# Altium project delta-sigma_modulator.PrjPcb
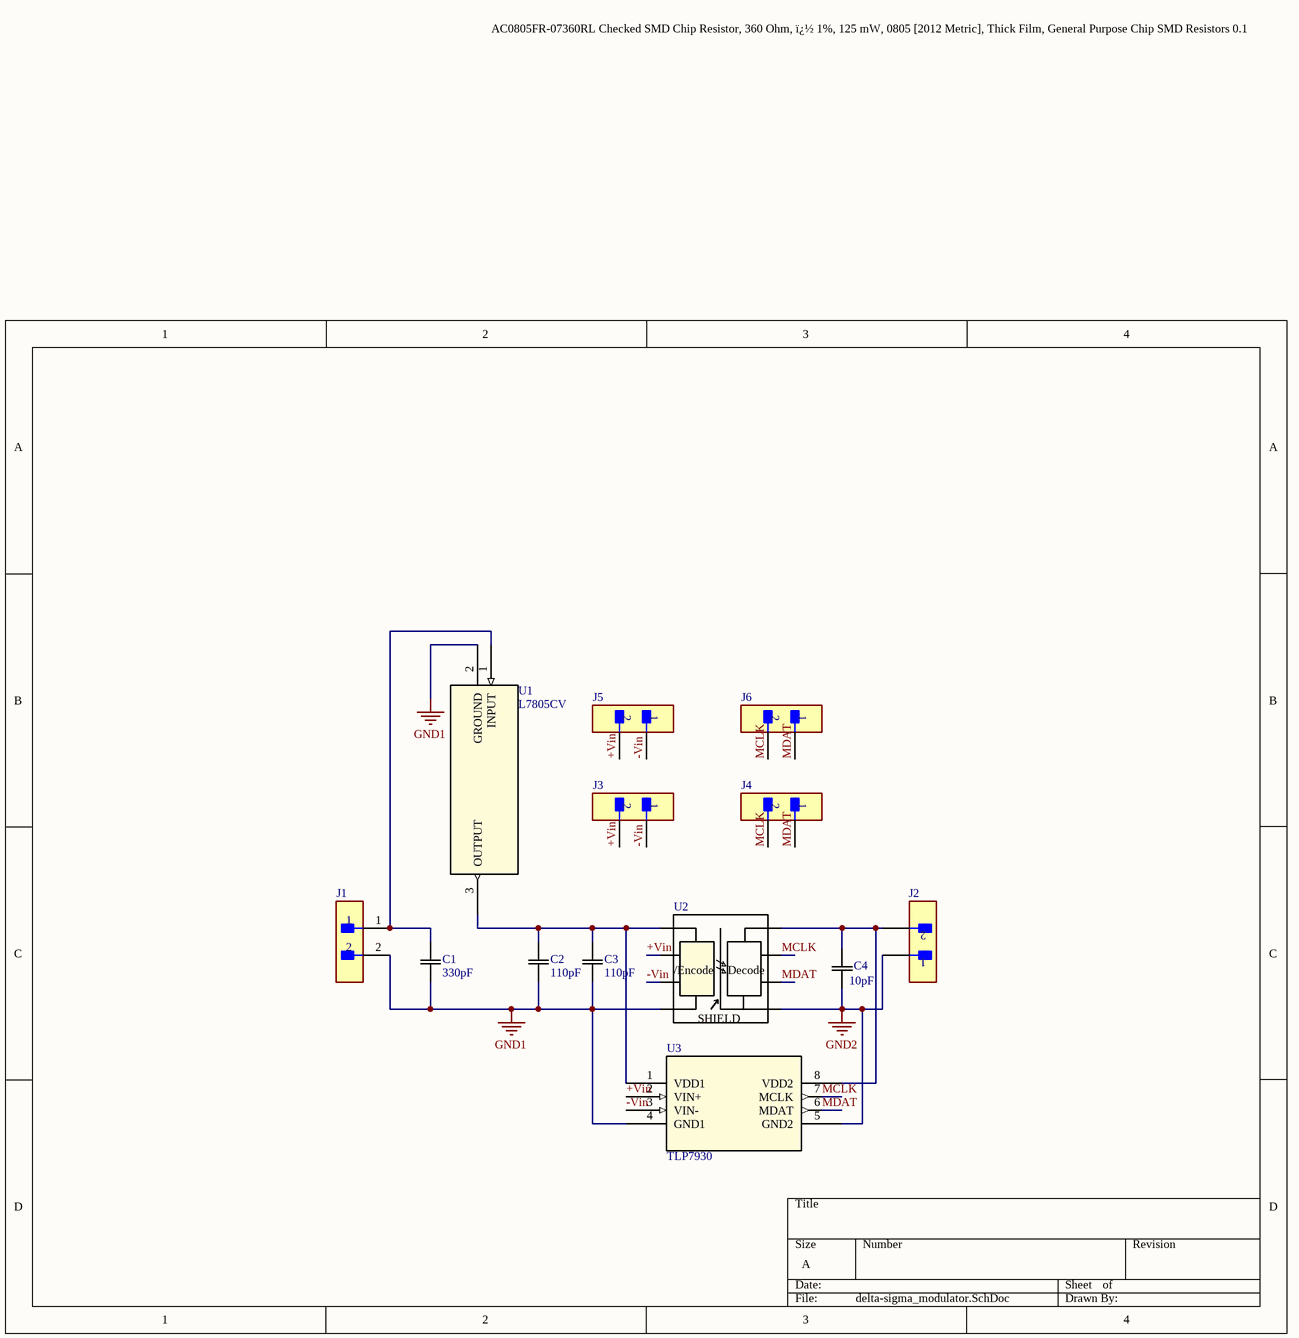
[diagram p0: delta-sigma_modulator.SchDoc]
1 sheet, 13 parts. Net scope: global (net labels, ports and power ports of the same name join across sheets).
Board file: delta-sigma_modulator.PcbDoc

## Sheet delta-sigma_modulator.SchDoc
size A; SheetNumber: 1; SheetTotal: 1

### Parts
C1  330pF  [CAP_FG28_TDK]
C2  110pF  [CAP_FG28_TDK]
C3  110pF  [CAP_FG28_TDK]
C4  10pF  [CAP_C322C511_MR_KEM]
J1  M20-9990246  [FP-M20-9990246-MFG]  (value not drawn)
J2  M20-9990246  [FP-M20-9990246-MFG]  (value not drawn)
J3  M20-9990246  [FP-M20-9990246-MFG]  (value not drawn)
J4  M20-9990246  [FP-M20-9990246-MFG]  (value not drawn)
J5  M20-9990246  [FP-M20-9990246-MFG]  (value not drawn)
J6  M20-9990246  [FP-M20-9990246-MFG]  (value not drawn)
U1  L7805CV  [TO-220_STM]
U2  TLP7830TP4,E  [SO8L_TOS]  (value not drawn)
U3  TLP7930  [DIP8_TOS]

### Nets
GND1: C1.1 C2.1 C3.1 J1.2 U1.2(GROUND) U2.4 U3.4(GND1)
GND2: C4.1 J2.2 U2.5 U3.5(GND2)
+Vin: J3.2 J5.2 U2.2 U3.2(VIN+)
-Vin: J3.1 J5.1 U2.3 U3.3(VIN-)
MCLK: J4.2 J6.2 U2.7 U3.7(MCLK)
MDAT: J4.1 J6.1 U2.6 U3.6(MDAT)
NetC1_2: C1.2 J1.1 U1.1(INPUT)
NetC2_2: C2.2 C3.2 U1.3(OUTPUT) U2.1 U3.1(VDD1)
NetC4_2: C4.2 J2.1 U2.8 U3.8(VDD2)

### Notes on the sheet
- AC0805FR-07360RL	Checked	SMD Chip Resistor, 360 Ohm, ï¿½ 1%, 125 mW, 0805 [2012 Metric], Thick Film, General Purpose	Chip SMD Resistors	0.1
- (in symbol TLP7830TP4,E) /Encode; Decode; SHIELD

### Library data of the parts
C1 = FG28C0G1H331JNT06: No Description Available; Mfr_Name: TDK
C2 C3 = FG28C0G1H100DNT06: No Description Available; Mfr_Name: TDK
C4 = C322C111JDG5TA: No Description Available; Mfr_Name: Kemet
J1-J6 = CMP-15831-000009-1: CONN HEADER VERT 2POS 2.54MM; Manufacturer: Harwin; Conn Gender: Male; Conn Orientation: Vertical; Number Of Contacts: 2; Current Rating: 3A; ComponentLink2URL: https://cdn.harwin.com/pdfs/M20-999.pdf; ComponentLink2Description: Datasheet; Package: M20-9990246; Temperature: -40°C to +105°C; Octopart: https://octopart.com/m20-9990246-harwin-2590635; Mouser Description: 2.54mm (0.1") Pitch SIL Vertical PC Tail Pin Header, 6.1mm mating pin height, tin, 2 contacts; Temperature Range High: +105°C; Device Class L1: Connectors; RoHS: TRUE; Automotive: No; Height: 8.99mm; Number Of Rows: 1; Contact Material: Tin,Nickel; Category: Conn; Pitch: 2.54mm; Lead Free: Yes; Digikey Description: CONN HEADER VERT 2POS 2.54MM; Manufacturer Part Number: M20-9990246; Temperature Range Low: -40°C; Device Class L3: unset; Device Class L2: Headers and Wire Housings
U1 = L7805CV: Linear Voltage Regulator, Fixed, Positive Output, 35 V, 5 V, 1.5 A, 3 Pins, TO-220; Mfr_Name: STMicroelectronics; Number of Outputs: 1; Output Voltage: 5V; Max Input Voltage: 35V; Max Output Current: 1.5A; Quiescent Current: 8mA; Dropout Voltage: 2V; Min Input Voltage: 7V; Power Supply Rejection Ratio (PSRR): 62dB; Tolerance: 5%; Min Output Voltage: 4.65V; RefDes: RefDes; Type: Type; Supplier 1: Digikey; Manufacturer: STMicroelectronics; Manufacturer Part Number: L7805CV; RoHS: No; Category: Voltage Regulators - Linear; Stock 1: 39349; Pricing 1: 1=0.53, 10=0.375, 50=0.3118, 100=0.2922, 250=0.27136, 500=0.2588, 1000=0.24847, 2500=0.23757, 5000=0.23099 (USD); Mount: Through Hole; Case/Package: TO-220; Number of Pins: 3; Contact Plating: Gold; Weight: 2.299997g; Min Operating Temperature: -40°C; Max Operating Temperature: 125°C; Output Type: Fixed; Polarity: Positive; Output Current: 1.5A; Number of Channels: 1; Number of Regulators: 1; Nominal Output Voltage: 5V; Length: 10.4mm; Width: 4.6mm; Height: 9.15mm; Radiation Hardening: No; Lead Free: Lead Free; Reach SVHC Compliant: No; ComponentLink1URL: https://datasheet.ciiva.com/29156/156048-da-01-en-spannungsregler-l-7805-cv-to220-stm-29156924.pdf?src-supplier=Conrad; ComponentLink1Description: https://datasheet.ciiva.com/29156/156048-da-01-en-spannungsregler-l-7805-cv-to220-stm-29156924.pdf?src-supplier=Conrad; ComponentLink2URL: https://datasheet.ciiva.com/6884/1805459-6884463.pdf?src-supplier=Newark; ComponentLink2Description: https://datasheet.ciiva.com/6884/1805459-6884463.pdf?src-supplier=Newark; ComponentLink3URL: https://datasheet.ciiva.com/2073/cd00000444-2073087.pdf?src-supplier=Digikey; ComponentLink3Description: https://datasheet.ciiva.com/2073/cd00000444-2073087.pdf?src-supplier=Digikey; ComponentLink4URL: https://datasheet.ciiva.com/16458/cd00000444-16458159.pdf?src-supplier=Future+Electronics; ComponentLink4Description: https://datasheet.ciiva.com/16458/cd00000444-16458159.pdf?src-supplier=Future+Electronics; Supplier Part Number 1: 497-1443-5-ND
U2 = TLP7830TP4,E: Isolation Amplifier Single 5000Vrms 5V 8-Pin SOIC T/R; Mfr_Name: Toshiba Electronic Devices & Storage Corp.; Manufacturer: Toshiba; Manufacturer Part Number: TLP7830(TP4,E; Number_devices_in_Package: 1; Source_Package: TLP7830; RefDes: Refdes; Type: Type; Supplier 1: Digikey; RoHS: Yes; Category: Linear ICs; Stock 1: 1205; Pricing 1: 1=6.34, 10=4.768, 100=3.8437, 500=3.519 (USD); RoHS Compliant: Yes; Supplier Part Number 1: TLP7830(TP4ECT-ND
U3 = TLP7930: No Description Available; Mfr_Name: Toshiba Electronic Devices & Storage Corp.; RefDes: RefDes; Type: Type